# EasyEDA Pro project STM32F103C8T6_课设.eprj

# Schematic Mainboard
Create Date: 2023-09-07; Page Name: P1.Mainboard; Project Name: STM32F103C8T6_CAN; Schematic Name: Mainboard; Update Date: 2023-10-06; Company: 嘉立创EDA; Page Size: A4; Version: V1.0
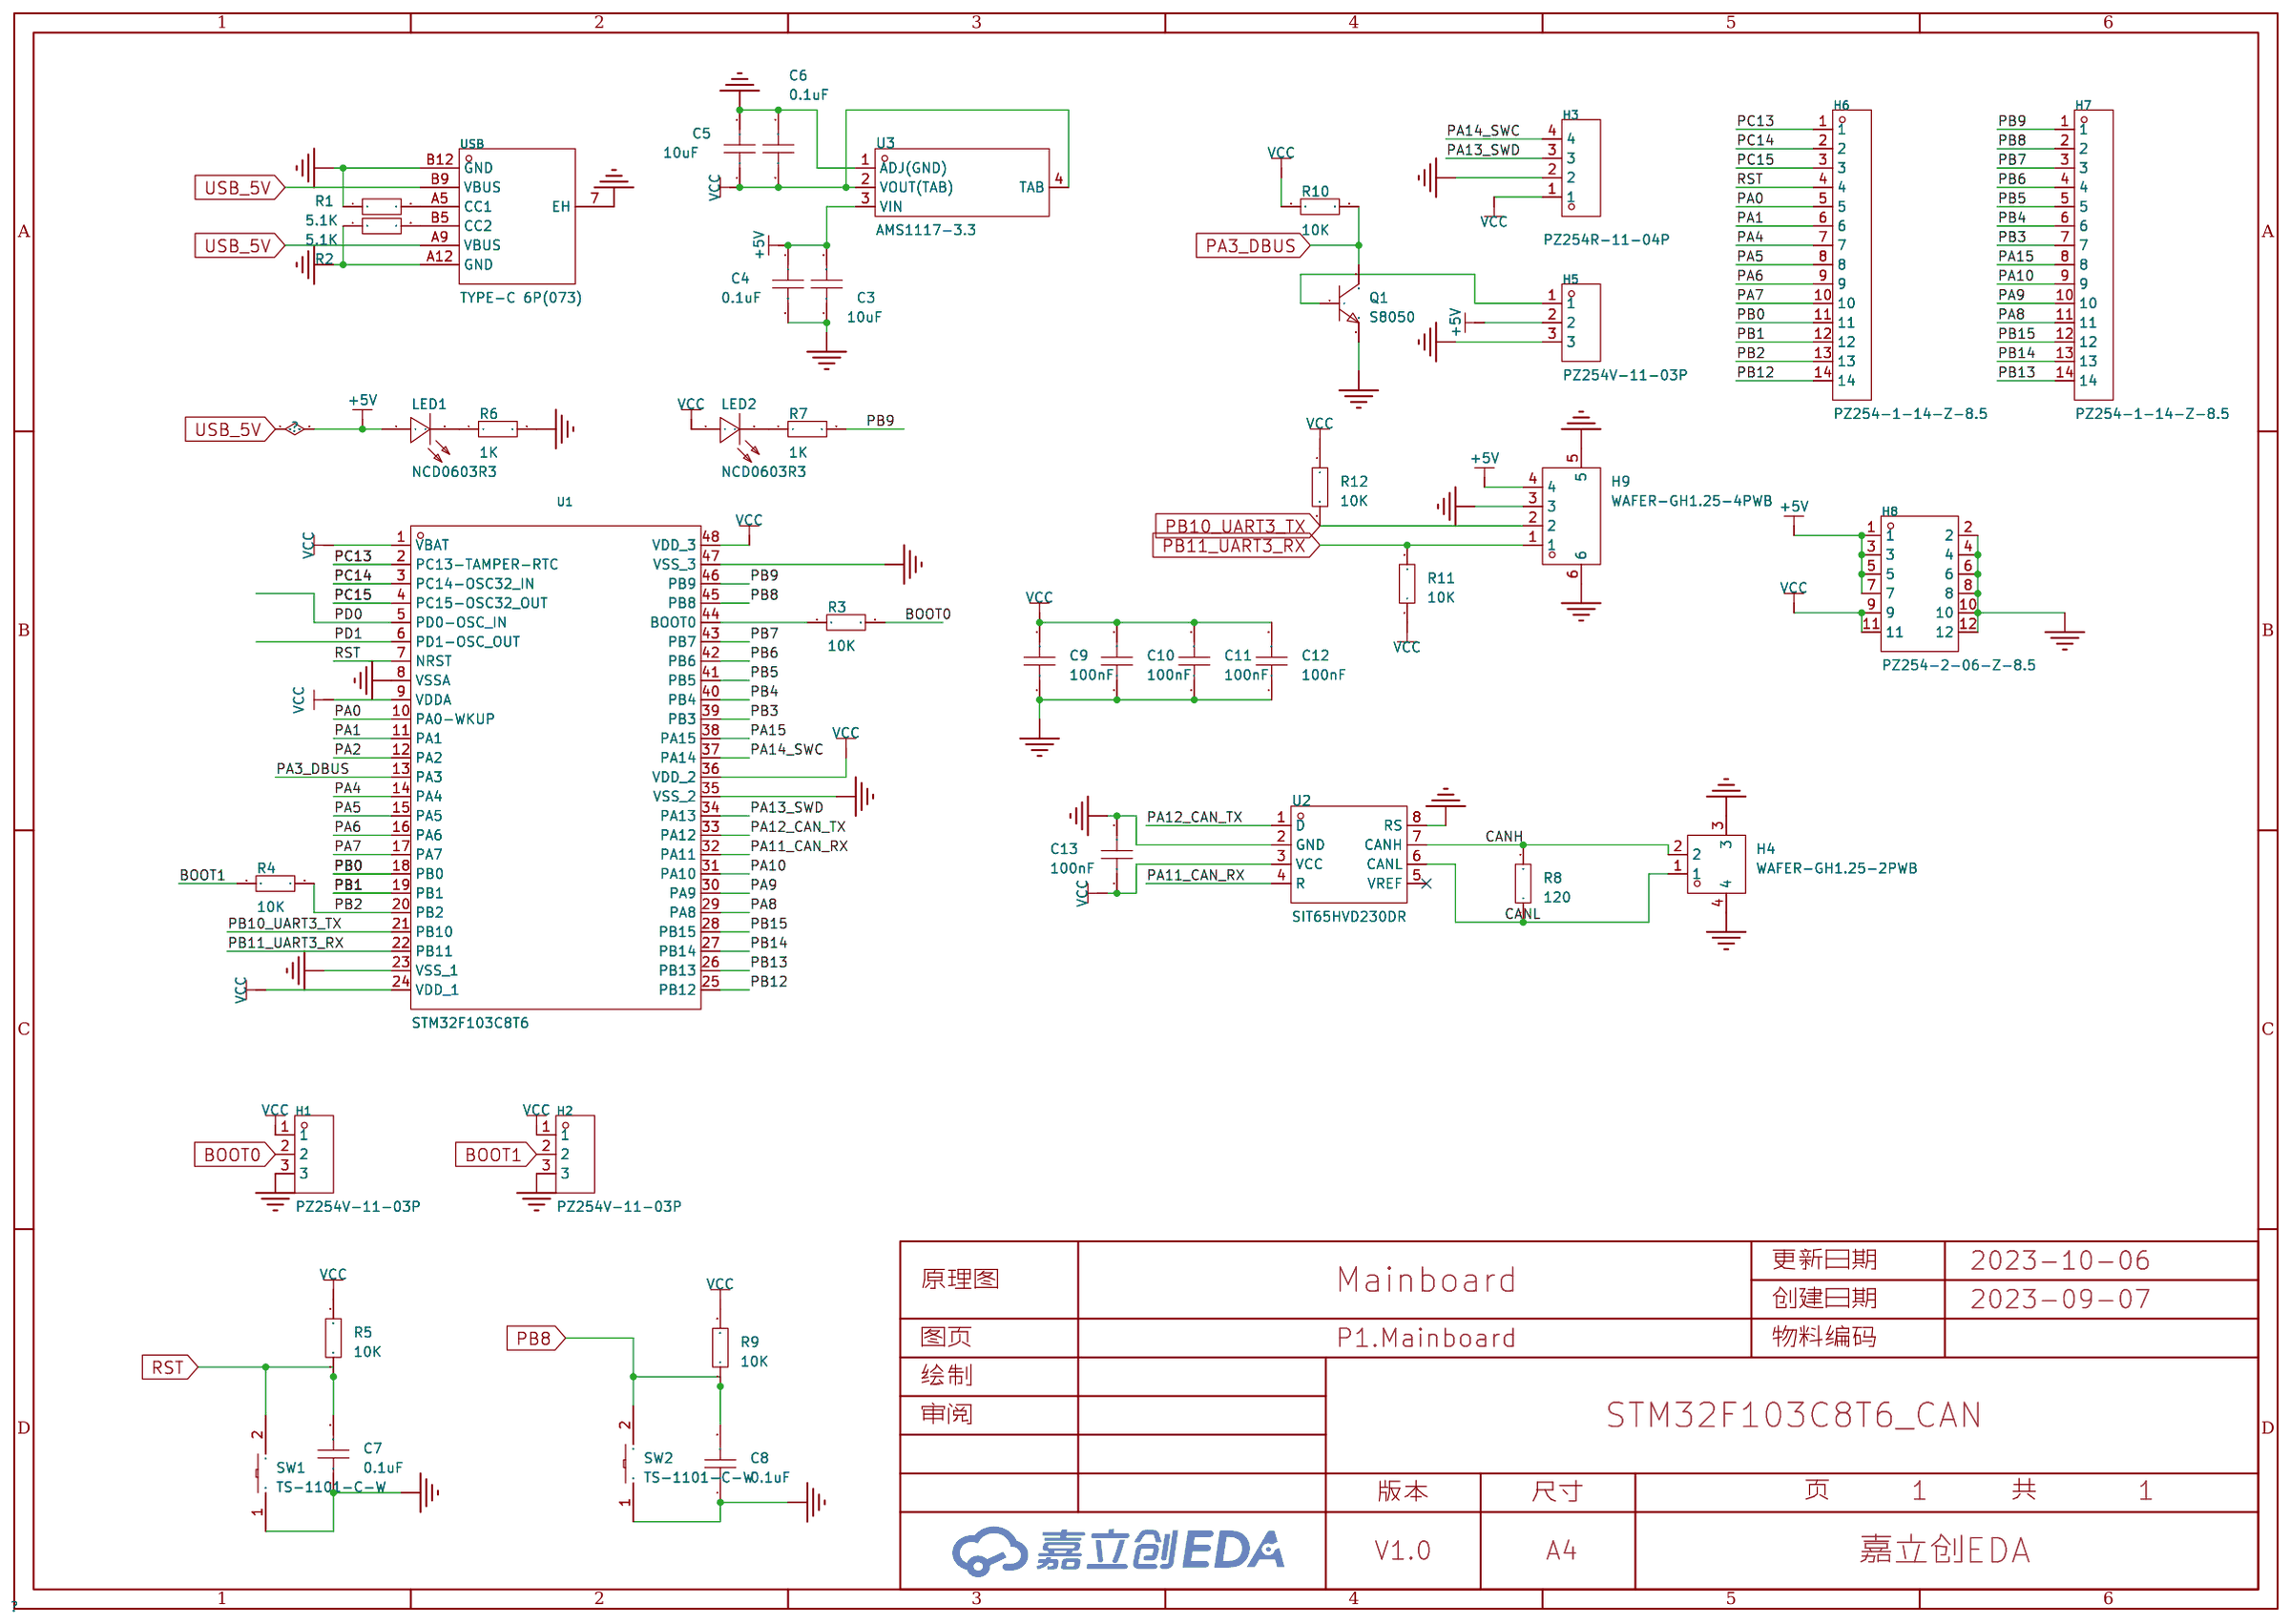
[diagram p0: schematic sheet]

## Parts
C3  10uF  [C0603]
C4  0.1uF  [C0603]
C5  10uF  [C0603]
C6  0.1uF  [C0603]
C7  0.1uF  [C0603]
C8  0.1uF  [C0603]
C9  100nF  [C0603]
C10  100nF  [C0603]
C11  100nF  [C0603]
C12  100nF  [C0603]
C13  100nF  [C0603]
CBB1  7327a17c6a034b8494f9f34925484f96
H1  PZ254V-11-03P  [HDR-TH_3P-P2.54-V-M]
H2  PZ254V-11-03P  [HDR-TH_3P-P2.54-V-M]
H3  PZ254R-11-04P  [HDR-TH_4P-P2.54-H-M-W10.4]
H4  WAFER-GH1.25-2PWB  [CONN-TH_2P-P1.25_XUNPU_WAFER-GH1.25-2PWB]
H5  PZ254V-11-03P  [HDR-TH_3P-P2.54-V-M]
H6  PZ254-1-14-Z-8.5  [HDR-TH_14P-P2.54-V-M]
H7  PZ254-1-14-Z-8.5  [HDR-TH_14P-P2.54-V-M]
H8  PZ254-2-06-Z-8.5  [HDR-TH_12P-P2.54-V-M-R2-C6-S2.54]
H9  WAFER-GH1.25-4PWB  [CONN-SMD_4P-P1.25_XUNPU_WAFER-GH1.25-4PWB]
LED1  NCD0603R3  [LED0603-R-RD_RED]
LED2  NCD0603R3  [LED0603-R-RD_RED]
Q1  S8050  [SOT-23-3_L2.9-W1.6-P1.90-LS2.8-BR]
R1  5.1K  [R0603]
R2  5.1K  [R0603]
R3  10K  [R0603]
R4  10K  [R0603]
R5  10K  [R0603]
R6  1K  [R0603]
R7  1K  [R0603]
R8  120  [R0603]
R9  10K  [R0603]
R10  10K  [R0603]
R11  10K  [R0603]
R12  10K  [R0603]
SW1  TS-1101-C-W  [SW-SMD_L6.0-W3.3-LS8.0]
SW2  TS-1101-C-W  [SW-SMD_L6.0-W3.3-LS8.0]
U1  STM32F103C8T6  [LQFP-48_L7.0-W7.0-P0.50-LS9.0-BL]
U2  SIT65HVD230DR  [SOP-8_L4.9-W3.9-P1.27-LS6.0-BL]
U3  AMS1117-3.3  [SOT-223-4_L6.5-W3.5-P2.30-LS7.0-BR]
USB  TYPE-C 6P(073)  [TYPE-C-SMD_TYPE-C-6P]

## Library data of the parts
C3-C13 = CAP_0603: Supplier Footprint: 0603
H1 H2 H5 = PZ254V-11-03P: 排数:单排;总PIN位数:3;间距:2.54mm;插针结构:1x3P;行距:-;安装类型:直插;圆针/方针:方针;额定电流:3A;额定电压:250V;配合针长度:6mm;塑高:2.5mm;端接针长度:3mm;工作温度范围:-40℃~+105℃;颜色:黑色;; LCSC Part Name: 2.54mm 1x3P 直插 方针; Supplier Part: C2937625; Manufacturer: XFCN(兴飞); Supplier Footprint: 直插,P=2.54mm; JLCPCB Part Class: Extended Part; Datasheet: 2022-07-12/581362A/62b9d00620994b3696be7eb4af85ad72/双排排针和单排排针.pdf; Supplier: LCSC; Number of Rows: 单排; Number of Pins: 3; Pitch: 2.54mm; Pin Structure: 1x3P; Mounting Type: 直插; Circluar Pins/Square Pins: 方针; Current Rating (Max): 3A; Voltage Rating (Max): 250V; Length of Mating Pin: 6mm; Insulation Height: 2.5mm; Length of End Connection Pin: 3mm; Operating Temperature Range: -40℃~+105℃; Color: 黑色
H3 = PZ254R-11-04P: 间距:2.54mm;总PIN位数:4;排数:1;插针结构:1x4P;行距:-;安装类型:弯插;圆针/方针:方针;额定电流:-;额定电压:-;配合针长度:6mm;塑高:2.5mm;触头材质:黄铜;触头镀层:-;工作温度范围:-40℃~+105℃;颜色:黑色;; LCSC Part Name: 2.54mm 1x4P 弯插 方针; Supplier Part: C492412; Manufacturer: XFCN(兴飞); Supplier Footprint: 插件,P=2.54mm; JLCPCB Part Class: 扩展库; Supplier: LCSC; Pitch: 2.54mm; Number of Pins: 4; Number of Rows: 1; Pin Structure: 1x4P; Mounting Type: 弯插; Circluar Pins/Square Pins: 方针; Length of Mating Pin: 6mm; Insulation Height: 2.5mm; Contact Material: 黄铜; Operating Temperature Range: -40℃~+105℃; Color: 黑色
H4 = WAFER-GH1.25-2PWB: 参考系列:GH;间距:1.25mm;插针结构:1x2P;排数:1;每排PIN数:2;公母:公型插针;安装方式:卧贴;额定电流:1A;工作温度范围:-25℃~+85℃;; LCSC Part Name: GH 1.25mm 1x2P 卧贴 带扣; Supplier Part: C3029377; Manufacturer: XUNPU(讯普); Supplier Footprint: SMD,P=1.25mm; JLCPCB Part Class: 扩展库; Datasheet: https://atta.szlcsc.com/upload/public/pdf/source/20220527/CB8773BFB0913C3B8ABD62CB38BA101A.pdf; Supplier: LCSC; Reference Series: GH; Pitch: 1.25mm; Pins Structure: 1x2P; Number of Rows: 1; Number of PINs Per Row: 2; Gender: 公型插针; Mounting Style: 卧贴; Current Rating (Max): 1A; Operating Temperature Range: -25℃~+85℃
H6 H7 = PZ254-1-14-Z-8.5: 排数:单排;总PIN位数:14P;间距:2.54mm;插针结构:1x14P;行距:-;安装类型:直插;圆针/方针:方针;额定电流:3A;额定电压:-;配合针长度:6mm;塑高:2.5mm;端接针长度:3mm;触头材质:-;工作温度范围:-40℃~+105℃;颜色:黑色;; LCSC Part Name: 2.54mm 1x14P 直插 方针; Supplier Part: C2894937; Manufacturer: HCTL(华灿天禄); Supplier Footprint: 插件,P=2.54mm; JLCPCB Part Class: 扩展库; Datasheet: https://atta.szlcsc.com/upload/public/pdf/source/20230609/805D25CEF03592837AF6F506EEB5ED41.pdf; Supplier: LCSC; Number of Rows: 单排; Number of Pins: 14P; Pitch: 2.54mm; Pin Structure: 1x14P; Mounting Type: 直插; Circluar Pins/Square Pins: 方针; Current Rating (Max): 3A; Length of Mating Pin: 6mm; Insulation Height: 2.5mm; Length of End Connection Pin: 3mm; Operating Temperature Range: -40℃~+105℃; Color: 黑色
H8 = PZ254-2-06-Z-8.5: 排数:双排;总PIN位数:12;间距:2.54mm;插针结构:2x6P;行距:2.54mm;安装类型:直插;圆针/方针:方针;额定电流:3A;额定电压:-;配合针长度:6mm;塑高:2.5mm;端接针长度:3mm;触头材质:-;工作温度范围:-40℃~+105℃;颜色:黑色;; LCSC Part Name: 2.54mm 2x6P 直插 方针; Supplier Part: C2894967; Manufacturer: HCTL(华灿天禄); Supplier Footprint: 直插,P=2.54mm; JLCPCB Part Class: 扩展库; Supplier: LCSC; Number of Rows: 双排; Number of Pins: 12; Pitch: 2.54mm; Pin Structure: 2x6P; Row Spacing: 2.54mm; Mounting Type: 直插; Circluar Pins/Square Pins: 方针; Current Rating (Max): 3A; Length of Mating Pin: 6mm; Insulation Height: 2.5mm; Length of End Connection Pin: 3mm; Operating Temperature Range: -40℃~+105℃; Color: 黑色
H9 = WAFER-GH1.25-4PWB: 参考系列:GH;间距:1.25mm;插针结构:1x4P;排数:1;每排PIN数:4;公母:公型插针;安装方式:卧贴;额定电流:1A;工作温度范围:-25℃~+85℃;; LCSC Part Name: GH1.25mm 4P 卧贴带扣 带扣; Supplier Part: C3029379; Manufacturer: XUNPU(讯普); Supplier Footprint: SMD,P=1.25mm; JLCPCB Part Class: 扩展库; Datasheet: https://atta.szlcsc.com/upload/public/pdf/source/20220527/CB8773BFB0913C3B8ABD62CB38BA101A.pdf; Supplier: LCSC; Reference Series: GH; Pitch: 1.25mm; Pins Structure: 1x4P; Number of Rows: 1; Number of PINs Per Row: 4; Gender: 公型插针; Mounting Style: 卧贴; Current Rating (Max): 1A; Operating Temperature Range: -25℃~+85℃
LED1 LED2 = NCD0603R3: 尺寸1.6x0.8x0.8；IF=20ma：1.6~2.6v，620~640nm,51~150mcd金线，光强高，功耗低，可靠性好，寿命长; LCSC Part Name: 红色;贴片LED;0603红灯;; Supplier Part: C3151730; Manufacturer: 国星光电; Supplier Footprint: 0603; JLCPCB Part Class: 扩展库; Datasheet: https://atta.szlcsc.com/upload/public/pdf/source/20220704/CBFF28C1847A97213A75929E60B7DDE7.pdf; Supplier: LCSC
Q1 = S8050_C181158: 晶体管类型:NPN;集射极击穿电压(Vceo):25V;集电极电流(Ic):500mA;功率(Pd):300mW;; LCSC Part Name: NPN 25V 500mA; Supplier Part: C181158; Manufacturer: Hottech(合科泰); Supplier Footprint: SOT-23; JLCPCB Part Class: 扩展库; Datasheet: https://atta.szlcsc.com/upload/public/pdf/source/20220506/D987F39D56F2975D34EC7947E75C4ABC.pdf; Supplier: LCSC; Transistor Type: NPN; Collector-Emitter Breakdown Voltage (Vceo): 25V; Collector Current (Ic): 500mA; Power Dissipation (Pd): 300mW; Collector Cut-Off Current (Icbo): 100nA; Collector-Emitter Saturation Voltage (VCE(sat)@Ic,Ib): 600mV@500mA,50mA; Transition Frequency (fT): 150MHz; Operating Temperature: +150℃@(Tj)
R1-R12 = Res_0603: Supplier Footprint: 0603
SW1 SW2 = TS-1101-C-W: 触点电流:50mA;额定电压(AC):-;额定电压(DC):12V;额定功率:-;绝缘电阻:-;电路结构:单刀单掷;安装方式:立贴;带灯:无;作用力:260gf;机械寿命:5万次;带支架:否;; LCSC Part Name: 立贴 6*3.6*2.5mm 轻触开关 一型3*6*2.5有白ZD b拉伸白色带淡绿按键 卷装; Supplier Part: C318938; Manufacturer: XKB Connectivity(中国星坤); Supplier Footprint: SMD; JLCPCB Part Class: Extended Part; Datasheet: https://atta.szlcsc.com/upload/public/pdf/source/20200227/C318938_C2E53B1EEDE37D980A33616AC086DE53.pdf; Supplier: LCSC; Contact Current: 50mA; Voltage Rating (DC): 12V; Circuit: 单刀单掷; Mounting Style: 立贴; Actuator Style: 矩形按钮; Actuator/Cap Color: 白色带淡绿; With Lamp: 无; Operating Force: 260gf; Mechanical Life: 5万次; Operating Temperature: -30℃~+85℃; Switch Length: 6mm; Switch Width: 3.6mm; Switch Height: 2.5mm; Strike Gundam: 否
U1 = STM32F103C8T6: CPU内核:ARM Cortex-M3;CPU最大主频:72MHz;工作电压范围:2V~3.6V;内部振荡器:有;程序 FLASH容量:64K@x8bit;RAM总容量:20KB;EEPROM/数据 FLASH容量:-;GPIO端口数量:37;ADC(单元数/通道数/位数):1@x10ch/12bit;外设/功能/协议栈:看门狗；DMA；看门狗；片载温度传感器;工作温度范围:-40℃~+85℃;; LCSC Part Name: ARM Cortex-M3 72MHz 闪存：64K@x8bit RAM：20KB MSL=3; Supplier Part: C8734; Manufacturer: ST(意法半导体); Supplier Footprint: LQFP-48(7x7); JLCPCB Part Class: 基础库; Supplier: LCSC; CPU Core: ARM Cortex-M3; Maximum Frequency: 72MHz; Supply Voltage Range: 2V~3.6V; Internal Oscillator: 有; Program FLASH Size: 64K@x8bit; RAM Size: 20KB; GPIO Ports Number: 37; ADC (Units/Channels/bits): 1@x10ch/12bit; Peripherals / Functions / Protocol Stacks: 看门狗；DMA；看门狗；片载温度传感器; Operating Temperature Range: -40℃~+85℃
U2 = SIT65HVD230DR: 类型:-;; Supplier Part: C496619; Manufacturer: SIT(芯力特); Supplier Footprint: SOP-8; JLCPCB Part Class: Extended Part; Datasheet: https://atta.szlcsc.com/upload/public/pdf/source/20200313/C496619_AFEDC6182C941FC5FA6F8E58312D272B.pdf; Supplier: LCSC
U3 = AMS1117-3.3_C347222: 输出类型:固定;输出极性:正;最大输入电压:18V;输出电压:3.3V;输出电流:1A;电源纹波抑制比(PSRR):60dB@(120Hz);; Supplier Part: C347222; Manufacturer: UMW(广东友台半导体); Supplier Footprint: SOT-223; JLCPCB Part Class: 扩展库; Datasheet: https://atta.szlcsc.com/upload/public/pdf/source/20211011/50CC665C22E3A66C08379A4A74BDA25C.pdf; Supplier: LCSC; Output Type: 固定; Output Polarity: 正; Number of Outputs: 1; Maximum Input Voltage: 18V; Output Voltage: 3.3V; Dropout Voltage: 1.3V@(1A); Output Current: 1A; Power Supply Rejection Ratio (PSRR): 60dB@(120Hz)
USB = TYPE-C 6P(073): 连接器类型:Type-C;标准:-;公母:母座;触点数量:6P;端口数量:1;安装方式:卧贴;额定电流 - 电源:5A;工作温度范围:-25℃~+85℃;; LCSC Part Name: Type-C 母座 卧贴; Supplier Part: C668623; Manufacturer: SHOU HAN(首韩); Supplier Footprint: SMD; JLCPCB Part Class: 扩展库; Datasheet: https://atta.szlcsc.com/upload/public/pdf/source/20200618/C668623_A4B260DED7AC1949BAC6AE39E9F4CD80.pdf; Supplier: LCSC; Connector Type: Type-C; Gender: 母座; Number of Contacts: 6P; Number of Ports: 1; Mounting Style: 卧贴; Current Rating - Power (Max): 5A; Operating Temperature Range: -25℃~+85℃

## Nets
+5V: C3.2 C4.1 H5.2 H8.1 H8.3 H8.5 H8.7 H9.4 LED1.1(A) U3.3(VIN) USB.A9(VBUS) USB.B9(VBUS)
GND: C3.1 C4.2 C5.2 C6.1 C7.1 C8.1 C9.1 C10.1 C11.1 C12.1 C13.2 H1.3 H2.3 H3.2 H4.3 H4.4 H5.3 H8.2 H8.4 H8.6 H8.8 H8.10 H8.12 H9.3 H9.5 H9.6 Q1.2 R1.1 R2.1 R6.2 SW1.1 SW2.1 U1.8(VSSA) U1.23(VSS_1) U1.35(VSS_2) U1.47(VSS_3) U2.2(GND) U2.8(RS) U3.1(ADJ(GND)) USB.7(EH) USB.A12(GND) USB.B12(GND)
VCC: C5.1 C6.2 C9.2 C10.2 C11.2 C12.2 C13.1 H1.1 H2.1 H3.1 H8.9 H8.11 LED2.1(A) R5.2 R9.2 R10.1 R11.1 R12.1 U1.1(VBAT) U1.9(VDDA) U1.24(VDD_1) U1.36(VDD_2) U1.48(VDD_3) U2.3(VCC) U3.2(VOUT(TAB)) U3.4(TAB)
BOOT0: H1.2 R3.2
BOOT1: H2.2 R4.1
CANH: H4.2 R8.2 U2.7(CANH)
CANL: H4.1 R8.1 U2.6(CANL)
PA0: H6.5 U1.10(PA0-WKUP)
PA1: H6.6 U1.11(PA1)
PA2: U1.12(PA2)
PA3_DBUS: Q1.3 R10.2 U1.13(PA3)
PA4: H6.7 U1.14(PA4)
PA5: H6.8 U1.15(PA5)
PA6: H6.9 U1.16(PA6)
PA7: H6.10 U1.17(PA7)
PA8: H7.11 U1.29(PA8)
PA9: H7.10 U1.30(PA9)
PA10: H7.9 U1.31(PA10)
PA11_CAN_RX: U1.32(PA11) U2.4(R)
PA12_CAN_TX: U1.33(PA12) U2.1(D)
PA13_SWD: H3.3 U1.34(PA13)
PA14_SWC: H3.4 U1.37(PA14)
PA15: H7.8 U1.38(PA15)
PB0: H6.11 U1.18(PB0)
PB1: H6.12 U1.19(PB1)
PB2: H6.13 R4.2 U1.20(PB2)
PB3: H7.7 U1.39(PB3)
PB4: H7.6 U1.40(PB4)
PB5: H7.5 U1.41(PB5)
PB6: H7.4 U1.42(PB6)
PB7: H7.3 U1.43(PB7)
PB8: C8.2 H7.2 R9.1 SW2.2 U1.45(PB8)
PB9: H7.1 R7.2 U1.46(PB9)
PB10_UART3_TX: H9.2 R12.2 U1.21(PB10)
PB11_UART3_RX: H9.1 R11.2 U1.22(PB11)
PB12: H6.14 U1.25(PB12)
PB13: H7.14 U1.26(PB13)
PB14: H7.13 U1.27(PB14)
PB15: H7.12 U1.28(PB15)
PC13: H6.1 U1.2(PC13-TAMPER-RTC)
PC14: H6.2 U1.3(PC14-OSC32_IN)
PC15: H6.3 U1.4(PC15-OSC32_OUT)
PD0: CBB1.(X2) U1.5(PD0-OSC_IN) U1.6(PD1-OSC_OUT)
RST: C7.2 H6.4 R5.1 SW1.2 U1.7(NRST)
$1N3196: R3.1 U1.44(BOOT0)
$1N3644: LED1.2(K) R6.1
$1N3970: LED2.2(K) R7.1
$1N9993: R2.2 USB.B5(CC2)
$1N9997: R1.2 USB.A5(CC1)
Net-(H5-1): H5.1 Q1.1

Not connected (* = marked no-connect by the designer): U2 5(VREF)*

# Schematic Crystal
Create Date: 2023-09-08; Page Name: P1; Project Name: STM32F103C8T6_CAN; Schematic Name: 8M_Crystal; Update Date: 2023-09-11; Company: 嘉立创EDA; Page Size: A4; Version: V1.0
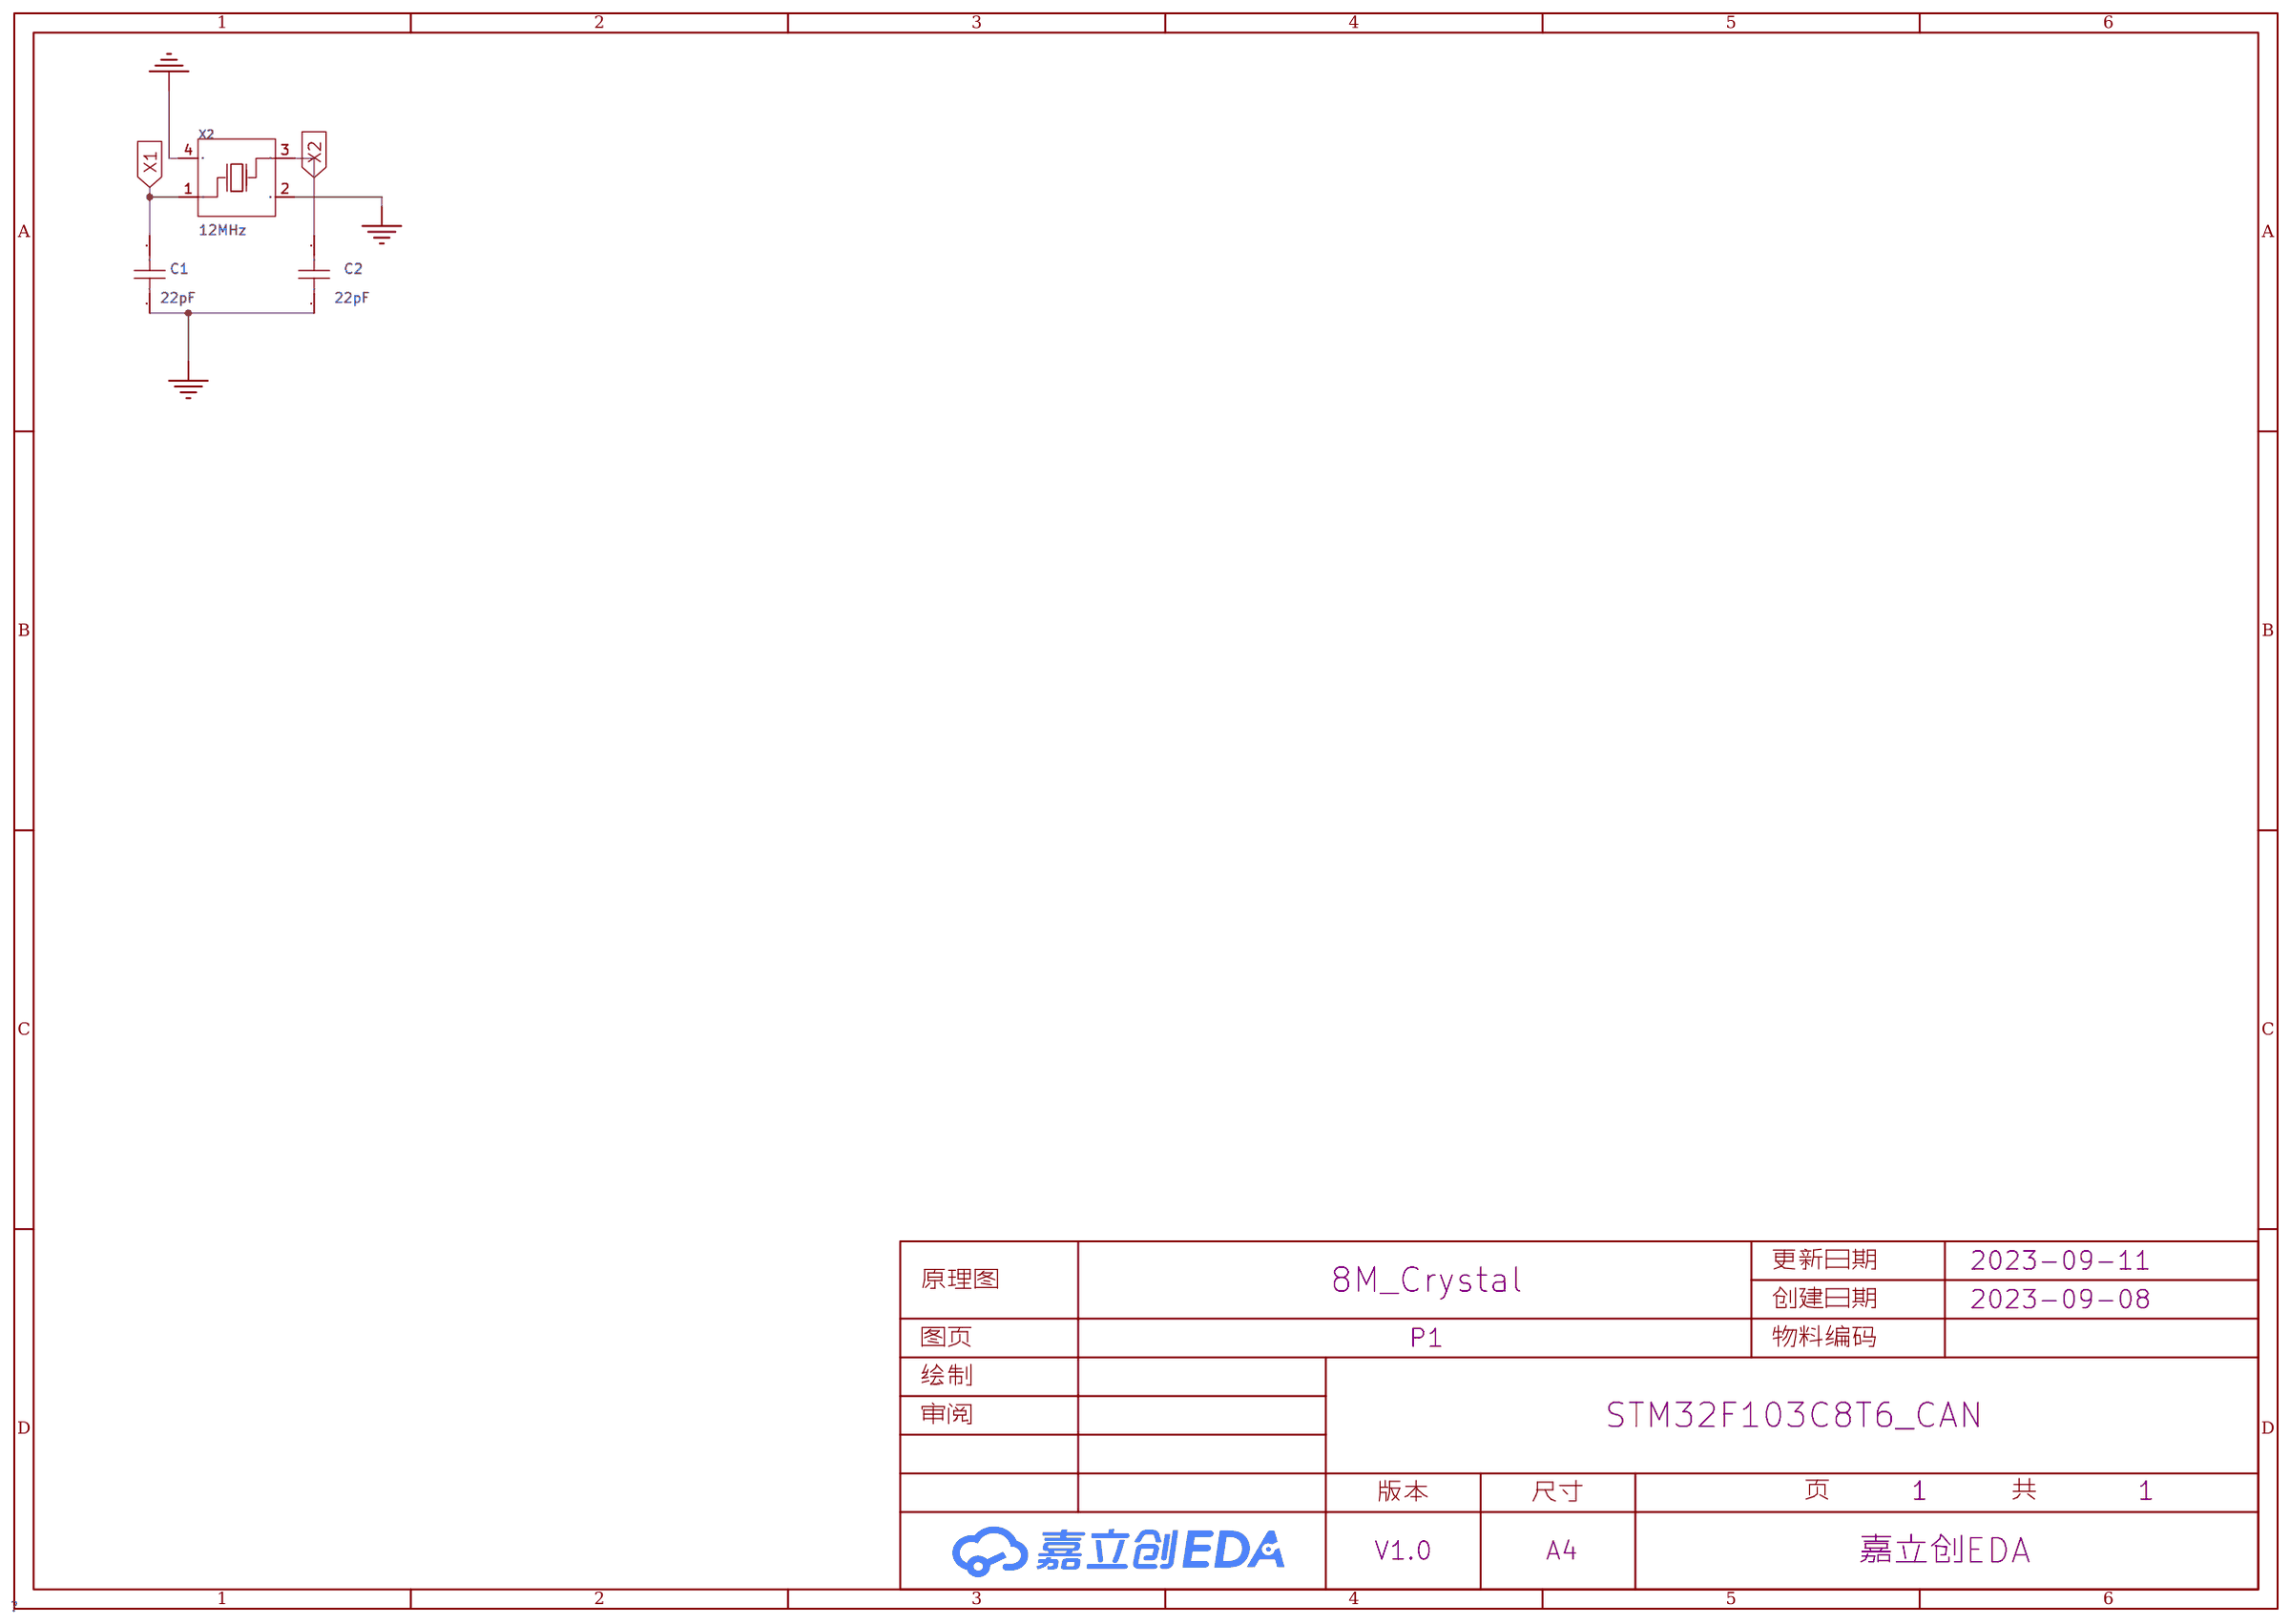
[diagram p1: schematic sheet]

## Parts
C1  22pF  [C0603]
C2  22pF  [C0603]
X2  12MHz  [OSC-SMD_4P-L3.2-W2.5-BL]

## Library data of the parts
C1 C2 = CAP_0603: Supplier Footprint: 0603
X2 = X322512MSB4SI: 频率:12MHz;频率公差:±10ppm;负载电容:20pF;; LCSC Part Name: 12MHz ±10ppm 20pF YSX321SL; Supplier Part: C9002; Manufacturer: YXC(扬兴晶振); Supplier Footprint: SMD3225-4P; JLCPCB Part Class: Basic Part; Datasheet: https://atta.szlcsc.com/upload/public/pdf/source/20210329/C112971_1F611BDC486E193C1706F6D8EB5AA189.pdf; Supplier: LCSC; Crystal Type: 贴片无源晶振; Frequency Tolerance: ±10ppm; Frequency Stability: ±30ppm; Load Capacitance: 20pF; Operating Temperature: -40℃~+85℃

## Nets
GND: C1.1 C2.1 X2.2(GND) X2.4(GND)
X1: C1.2 X2.1(OSC1)
X2: C2.2 X2.3(OSC2)

# Board PCB1
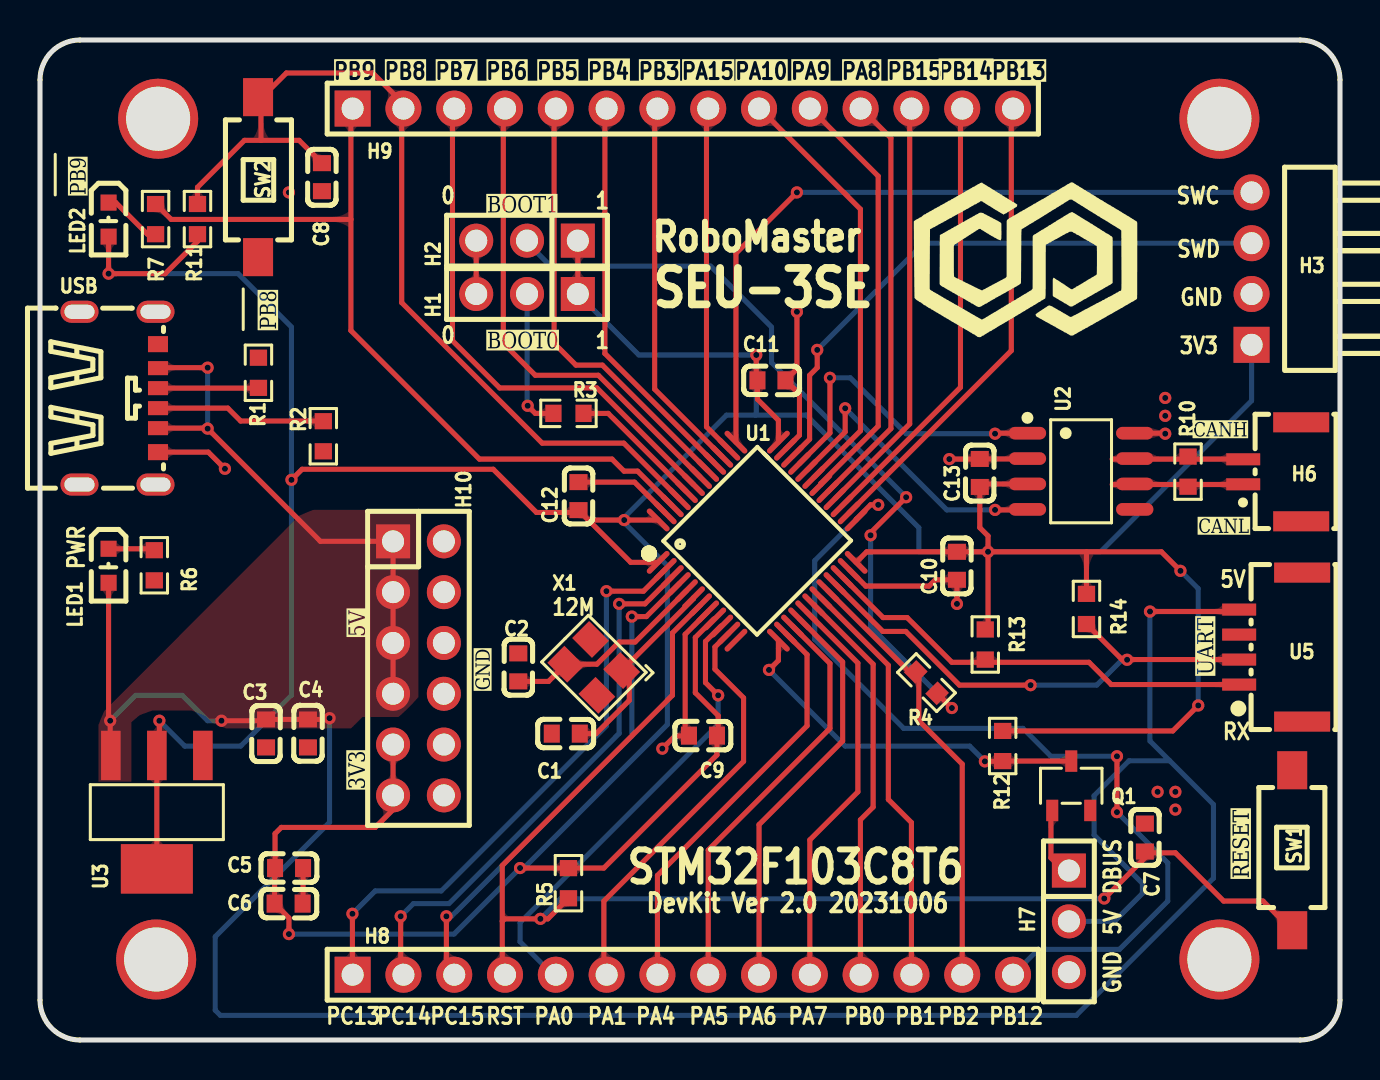
[diagram p2: board, top side]
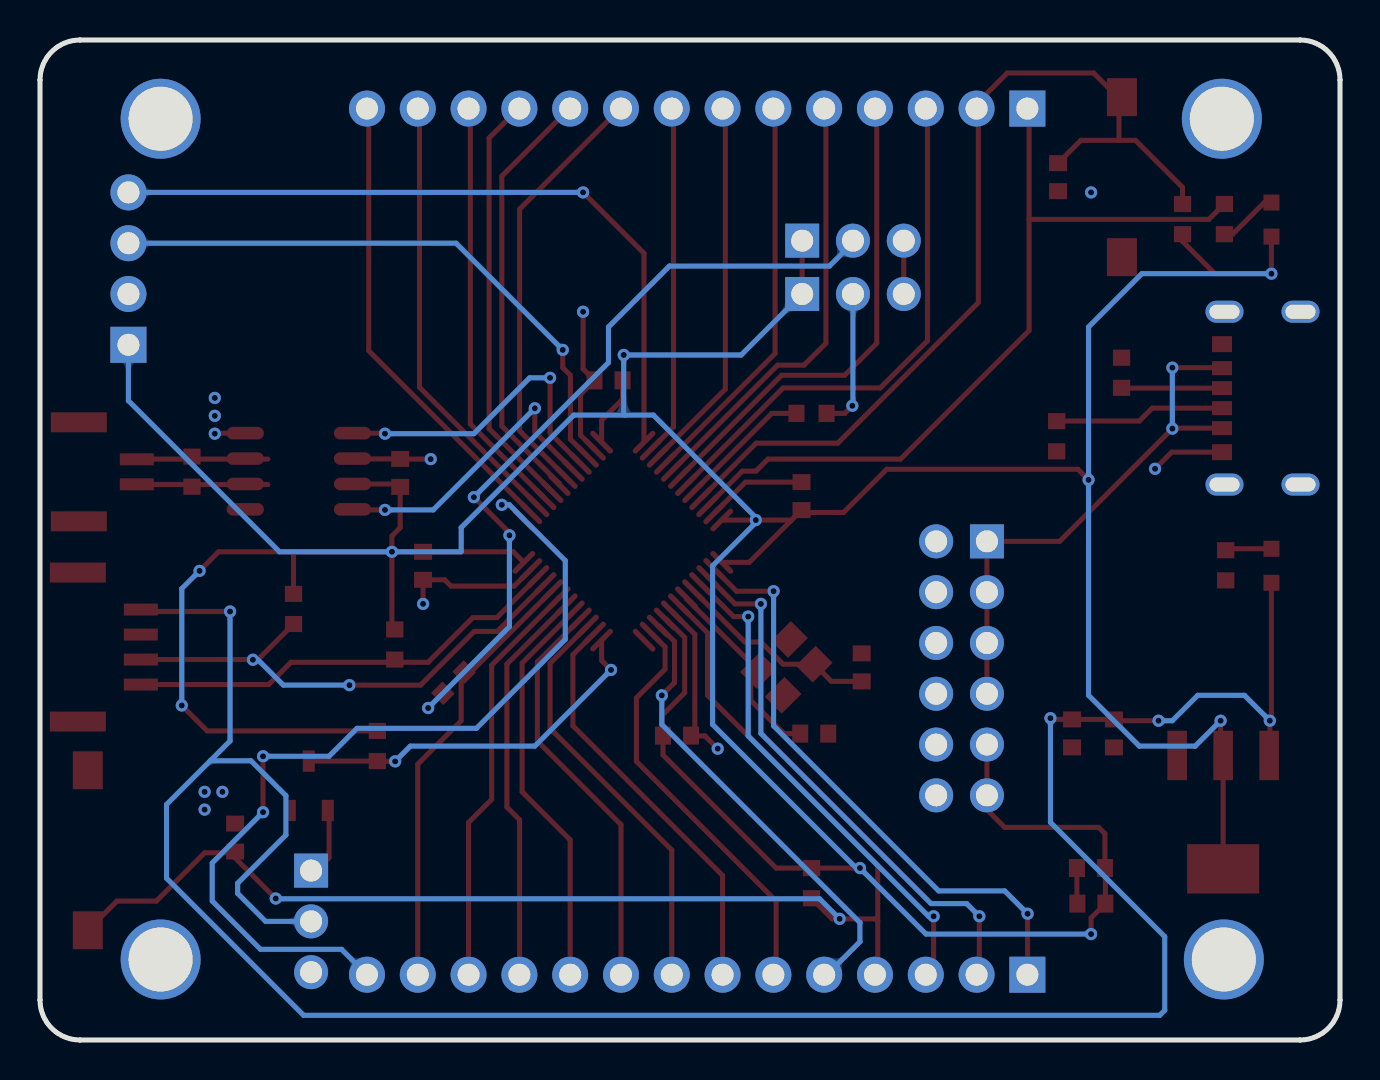
[diagram p3: board, bottom side, seen from below]

Outline 65 x 50 mm; copper layers: Top Layer, Bottom Layer. Coordinates in mm from the lower left corner of the outline.
Outline path: 0,48 0,2 arc(0.59,0.59) 2,0 63,0 arc(64.41,0.59) 65,2 65,48 arc(64.41,49.41) 63,50 2,50 arc(0.59,49.41) 0,48
Stack: Top Layer 0.035mm / Dielectric1 1.51mm FR4 er 4.5 / Bottom Layer 0.035mm

## Design rules (mm)
template: JLCPCB Capability(Two Layers Board)
spacing copperThickness1oz (default): track to track 0.102, other pairs 0.152 to 0.3
spacing copperThickness2oz: track to track 0.203, other pairs 0.152 to 0.3
track width copperThickness1oz (default): min 0.127, default 0.254, max 2.54
track width copperThickness2oz: min 0.203, default 0.254, max 2.54
differential pair differentialPair (default): width min 0.127, default 0.254, max 2.54; gap min 0.152, default 0.152
via viaSize (default): diameter min 0.5, default 0.61, max 10; hole min 0.3, default 0.305, max 6.3

## Placement (name value [footprint] x y rotation side)
C1  22pF  [C0603]  26.29 15.32 0 top
C2  22pF  [C0603]  23.91 18.63 270 top
C3  10uF  [C0603]  11.3 15.33 90 top
C4  0.1uF  [C0603]  13.4 15.33 270 top
C5  10uF  [C0603]  12.45 8.6 0 top
C6  0.1uF  [C0603]  12.43 6.82 180 top
C7  0.1uF  [C0603]  55.25 10.12 270 top
C8  0.1uF  [C0603]  14.1 43.14 90 top
C9  100nF  [C0603]  33.15 15.22 0 top
C10  100nF  [C0603]  45.85 23.71 90 top
C11  100nF  [C0603]  36.57 32.98 180 top
C12  100nF  [C0603]  26.92 27.19 270 top
C13  100nF  [C0603]  46.99 28.35 90 top
H1  PZ254V-11-03P  [HDR-TH_3P-P2.54-V-M]  24.35 37.3 180 top
H2  PZ254V-11-03P  [HDR-TH_3P-P2.54-V-M]  24.35 39.97 180 top
H3  PZ254R-11-04P  [HDR-TH_4P-P2.54-H-M-W10.4]  60.58 38.57 90 top
H6  PZ254-1-14-Z-8.5  [CONN-TH_2P-P1.25_XUNPU_WAFER-GH1.25-2PWB]  61.61 28.41 90 top
H7  PZ254-1-14-Z-8.5  [HDR-TH_3P-P2.54-V-M]  51.45 5.93 270 top
H8  PZ254-2-06-Z-8.5  [HDR-TH_14P-P2.54-V-M]  32.14 3.26 0 top
H9  WAFER-GH1.25-4PWB  [HDR-TH_14P-P2.54-V-M]  32.14 46.57 0 top
H10  PZ254-2-06-Z-8.5  [HDR-TH_12P-P2.54-V-M-R2-C6-S2.54]  18.92 18.58 270 top
LED1  NCD0603R3  [LED0603-R-RD_RED]  3.43 23.71 270 top
LED2  NCD0603R3  [LED0603-R-RD_RED]  3.43 41.02 270 top
NOREF  -  [Pad_e2540]  58.97 4.03 0 top
NOREF#2  -  [Pad_e2538]  58.97 46.06 0 top
NOREF#3  -  [Pad_e2198]  5.81 4.03 0 top
NOREF#4  -  [Pad_e825]  5.91 46.06 0 top
Q1  S8050  [SOT-23-3_L2.9-W1.6-P1.90-LS2.8-BR]  51.56 12.71 270 top
R1  5.1K  [R0603]  10.92 33.36 270 top
R2  5.1K  [R0603]  14.17 30.19 90 top
R3  10K  [R0603]  26.42 31.33 180 top
R4  10K  [R0603]  44.32 17.87 135 top
R5  10K  [R0603]  26.42 7.84 90 top
R6  1K  [R0603]  5.72 23.74 270 top
R7  1K  [R0603]  5.78 41.05 90 top
R10  10K  [R0603]  57.4 28.42 90 top
R11  10K  [R0603]  7.87 41.05 270 top
R12  10K  [R0603]  48.13 14.7 270 top
R13  10K  [R0603]  47.26 19.77 270 top
R14  10K  [R0603]  52.32 21.55 270 top
SW1  TS-1101-C-W  [SW-SMD_L6.0-W3.3-LS8.0]  62.61 9.49 270 top
SW2  TS-1101-C-W  [SW-SMD_L6.0-W3.3-LS8.0]  10.9 43.14 90 top
U1  STM32F103C8T6  [LQFP-48_L7.0-W7.0-P0.50-LS9.0-BL]  35.86 24.94 315 top
U2  SIT65HVD230DR  [SOP-8_L4.9-W3.9-P1.27-LS6.0-BL]  52.05 28.44 270 top
U3  AMS1117-3.3  [SOT-223-4_L6.5-W3.5-P2.30-LS7.0-BR]  5.84 11.39 90 top
U5  WAFER-GH1.25-4PWB  [CONN-SMD_4P-P1.25_XUNPU_WAFER-GH1.25-4PWB]  61.53 19.65 90 top
USB  TYPE-C 6P(073)  [TYPE-C-SMD_TYPE-C-6P]  3.94 32.09 270 top
X1  12MHz  [OSC-SMD_4P-L3.2-W2.5-BL]  27.69 18.63 135 top

## Footprints (pads in the part's own frame, mm; a bottom-side part is the same pattern mirrored in y, then rotated)
C0603
  rect 0.8x0.9 smd: 1(-0.7,0) 2(0.7,0)
CONN-SMD_4P-P1.25_XUNPU_WAFER-GH1.25-4PWB
  rect 0.6x1.7 smd: 1(-1.875,1.575) 2(-0.625,1.575) 3(0.625,1.575) 4(1.875,1.575)
  rect 1x2.8 smd: 5(3.725,-1.575) 6(-3.725,-1.575)
CONN-TH_2P-P1.25_XUNPU_WAFER-GH1.25-2PWB
  rect 0.6x1.7 smd: 1(-0.625,1.45) 2(0.625,1.45)
  rect 1x2.8 smd: 3(-2.475,-1.45) 4(2.475,-1.45)
HDR-TH_3P-P2.54-V-M
  rect 1.7x1.7 hole 1.1: 1(-2.54,0)
  round 1.7 hole 1.1: 2(0,0) 3(2.54,0)
HDR-TH_4P-P2.54-H-M-W10.4
  rect 1.8x1.8 hole 1.1: 1(-3.81,0)
  round 1.8 hole 1.1: 2(-1.27,0) 3(1.27,0) 4(3.81,0)
HDR-TH_12P-P2.54-V-M-R2-C6-S2.54
  rect 1.7x1.7 hole 1.1: 1(-6.35,-1.27)
  round 1.7 hole 1.1: 2(-6.35,1.27) 3(-3.81,-1.27) 4(-3.81,1.27) 5(-1.27,-1.27) 6(-1.27,1.27) 7(1.27,-1.27) 8(1.27,1.27) 9(3.81,-1.27) 10(3.81,1.27) 11(6.35,-1.27) 12(6.35,1.27)
HDR-TH_14P-P2.54-V-M
  rect 1.8x1.8 hole 1.1: 1(-16.51,0)
  round 1.8 hole 1.1: 2(-13.97,0) 3(-11.43,0) 4(-8.89,0) 5(-6.35,0) 6(-3.81,0) 7(-1.27,0) 8(1.27,0) 9(3.81,0) 10(6.35,0) 11(8.89,0) 12(11.43,0) 13(13.97,0) 14(16.51,0)
LED0603-R-RD_RED
  rect 0.8x0.8 smd: 1(0.851,0) 2(-0.851,0)
LQFP-48_L7.0-W7.0-P0.50-LS9.0-BL
  oval 0.27x1.5 smd: 1(-2.75,-4.25) 2(-2.25,-4.25) 3(-1.75,-4.25) 4(-1.25,-4.25) 5(-0.75,-4.25) 6(-0.25,-4.25) 7(0.25,-4.25) 8(0.75,-4.25) 9(1.25,-4.25) 10(1.75,-4.25) 11(2.25,-4.25) 12(2.75,-4.25) 25(2.75,4.25) 26(2.25,4.25) 27(1.75,4.25) 28(1.25,4.25) 29(0.75,4.25) 30(0.25,4.25) 31(-0.25,4.25) 32(-0.75,4.25) 33(-1.25,4.25) 34(-1.75,4.25) 35(-2.25,4.25) 36(-2.75,4.25)
  oval 1.5x0.27 smd: 13(4.25,-2.75) 14(4.25,-2.25) 15(4.25,-1.75) 16(4.25,-1.25) 17(4.25,-0.75) 18(4.25,-0.25) 19(4.25,0.25) 20(4.25,0.75) 21(4.25,1.25) 22(4.25,1.75) 23(4.25,2.25) 24(4.25,2.75) 37(-4.25,2.75) 38(-4.25,2.25) 39(-4.25,1.75) 40(-4.25,1.25) 41(-4.25,0.75) 42(-4.25,0.25) 43(-4.25,-0.25) 44(-4.25,-0.75) 45(-4.25,-1.25) 46(-4.25,-1.75) 47(-4.25,-2.25) 48(-4.25,-2.75)
OSC-SMD_4P-L3.2-W2.5-BL
  rect 1.4x1.2 smd: 1(-1.1,-0.875) 2(1.1,-0.875) 3(1.1,0.875) 4(-1.1,0.875)
Pad_e825
  round 4 hole 3.2: 15(0,0)
Pad_e2198
  round 4 hole 3.2: 15(0,0)
Pad_e2538
  round 4 hole 3.2: 15(0,0)
Pad_e2540
  round 4 hole 3.2: 15(0,0)
R0603
  rect 0.806x0.864 smd: 1(-0.753,0) 2(0.753,0)
SOP-8_L4.9-W3.9-P1.27-LS6.0-BL
  oval 0.63x1.865 smd: 1(-1.905,-2.683) 2(-0.635,-2.683) 3(0.635,-2.683) 4(1.905,-2.683) 5(1.905,2.683) 6(0.635,2.683) 7(-0.635,2.683) 8(-1.905,2.683)
SOT-23-3_L2.9-W1.6-P1.90-LS2.8-BR
  rect 1.07x0.6 smd: 1(1.235,-0.95) 2(1.235,0.95) 3(-1.235,0)
SOT-223-4_L6.5-W3.5-P2.30-LS7.0-BR
  rect 2.47x0.98 smd: 1(2.835,-2.3) 2(2.835,0) 3(2.835,2.3)
  rect 2.47x3.6 smd: 4(-2.835,0)
SW-SMD_L6.0-W3.3-LS8.0
  rect 1.9x1.5 smd: 1(-4,0) 2(4,0)
TYPE-C-SMD_TYPE-C-6P
  oval 1.1x1.9 hole 0.7x1.5: 7(-4.32,1.837) 7(-4.32,-1.962) 7(4.32,1.837) 7(4.32,-1.962)
  rect 0.7x1 smd: A5(-0.5,1.962) A9(1.5,1.962) B5(0.5,1.962) B9(-1.5,1.962)
  rect 0.8x1 smd: A12(2.7,1.962) B12(-2.7,1.962)

## Nets
+5V: C3.2 C4.1 H7.2 H10.1 H10.3 H10.5 H10.7 LED1.1 U3.3 U5.4 USB.A9 USB.B9
GND: C1.1 C2.1 C3.1 C4.2 C5.2 C6.1 C7.1 C8.1 C9.1 C10.1 C11.1 C12.1 C13.2 H1.3 H2.3 H3.2 H6.3 H6.4 H7.3 H10.2 H10.4 H10.6 H10.8 H10.10 H10.12 NOREF.15 NOREF#2.15 NOREF#3.15 NOREF#4.15 Q1.2 R1.1 R2.1 R6.2 SW1.1 SW2.1 U1.8 U1.23 U1.35 U1.47 U2.2 U2.8 U3.1 U5.3 U5.5 U5.6 USB.7 USB.A12 USB.B12 X1.2 X1.4
VCC: C5.1 C6.2 C9.2 C10.2 C11.2 C12.2 C13.1 H1.1 H2.1 H3.1 H10.9 H10.11 LED2.1 R5.2 R11.2 R12.1 R13.1 R14.1 U1.1 U1.9 U1.24 U1.36 U1.48 U2.3 U3.2 U3.4
BOOT0: H1.2 R3.2
BOOT1: H2.2 R4.1
CANH: H6.2 R10.2 U2.7
CANL: H6.1 R10.1 U2.6
PA0: H8.5 U1.10
PA1: H8.6 U1.11
PA2: U1.12
PA3_DBUS: Q1.3 R12.2 U1.13
PA4: H8.7 U1.14
PA5: H8.8 U1.15
PA6: H8.9 U1.16
PA7: H8.10 U1.17
PA8: H9.11 U1.29
PA9: H9.10 U1.30
PA10: H9.9 U1.31
PA11_CAN_RX: U1.32 U2.4
PA12_CAN_TX: U1.33 U2.1
PA13_SWD: H3.3 U1.34
PA14_SWC: H3.4 U1.37
PA15: H9.8 U1.38
PB0: H8.11 U1.18
PB1: H8.12 U1.19
PB2: H8.13 R4.2 U1.20
PB3: H9.7 U1.39
PB4: H9.6 U1.40
PB5: H9.5 U1.41
PB6: H9.4 U1.42
PB7: H9.3 U1.43
PB8: C8.2 H9.2 R11.1 SW2.2 U1.45
PB9: H9.1 R7.2 U1.46
PB10_UART3_TX: R14.2 U1.21 U5.2
PB11_UART3_RX: R13.2 U1.22 U5.1
PB12: H8.14 U1.25
PB13: H9.14 U1.26
PB14: H9.13 U1.27
PB15: H9.12 U1.28
PC13: H8.1 U1.2
PC14: H8.2 U1.3
PC15: H8.3 U1.4
PD0: C2.2 U1.5 X1.3
PD1: C1.2 U1.6 X1.1
RST: C7.2 H8.4 R5.1 SW1.2 U1.7
$1N3196: R3.1 U1.44
$1N3644: LED1.2 R6.1
$1N3970: LED2.2 R7.1
$1N9993: R2.2 USB.B5
$1N9997: R1.2 USB.A5
$1N21284: H7.1 Q1.1

Pads without a net: U2 5

## Via types
v1: diameter 0.61, hole 0.305, Top Layer to Bottom Layer, 54 vias

## Routing (per net, layer and track width the routed paths; a pad name or vN(x,y) marks a point on that pad's centre or on a via; arc(x,y) is an arc through that point)
+5V: length 151.9
  Top Layer w0.254: H10.7 H10.5 H10.3 H10.1 14.02,24.93 v1(8.38,30.57) 8.36,30.59 USB.A9 ; v1(14.48,16.09) 14.42,16.03 C4.1 C3.2 11.24,15.96 v1(9.07,15.96) ; v1(8.38,33.62) 5.92,33.62 USB.B9 ; v1(55.5,21.42) 59.86,21.42 59.96,21.52 ; 3.51,13.97 v1(3.51,15.96) 3.43,16.04 LED1.1
  Bottom Layer w0.254: 56.49,13.96 58.67,11.77 58.67,8.09 51.82,1.23 9.02,1.23 8.76,1.49 8.76,5.17 14.48,10.88 v1(14.48,16.09) ; 56.49,13.96 54.45,13.96 52.71,12.22 52.71,10.25 55.12,7.84 55.12,7.33 53.72,5.93 H7.2 ; 56.49,13.96 55.5,14.95 v1(55.5,21.42) ; v1(8.38,30.57) v1(8.38,33.62) ; v1(3.51,15.96) 4.78,17.23 7.11,17.23 8.38,15.96 v1(9.07,15.96)
GND: length 41.7
  Top Layer w0.254: v1(9.25,28.56) 8.41,29.39 USB.A12 ; v1(56.26,30.31) 56.24,30.34 54.74,30.34 ; U1.47 29.72,27.89 C12.1 ; 33.38,21.41 32.26,20.28 32.26,15.41 32.45,15.22 ; C9.1 32.43,15.2 31.75,15.2 v1(31.12,14.57) ; v1(45.47,29.05) 46.98,29.05 C13.2 49.35,29.05 U2.2 ; 37.27,29.54 37.97,30.24 37.97,32.28 C11.1 37.85,33.56 v1(37.85,36.41) ; v1(45.85,21.81) C10.1 44.77,23.01 44.45,22.69 41.29,22.69 U1.23 ; H2.3 H1.3 ; C6.1 13.15,6.84 C5.2
  vias: v1(12.45,42.38) v1(55.88,12.41) v1(56.26,32.1) v1(56.26,31.21) v1(56.77,12.41) v1(56.77,11.52)
VCC: length 255.2
  Top Layer w0.254: v1(5.97,15.96) 5.97,14.13 5.84,14.01 ; v1(12.45,5.3) 12.45,6.1 C6.2 11.73,8.57 C5.1 11.75,10.32 12.06,10.63 16.76,10.63 17.65,11.52 H10.11 H10.9 ; 58.04,16.85 56.64,15.45 R12.1 ; 33.69,21.05 32.77,20.13 32.77,17.36 33.91,16.22 33.91,15.55 33.85,15.48 C9.2 33.85,14.25 28.19,8.6 v1(24,8.6) ; U2.3 47.14,27.8 C13.1 46.99,25.62 47.4,25.2 v1(47.4,24.41) ; 52.32,24.41 v1(47.4,24.41) ; 52.32,24.41 56.07,24.41 v1(57.02,23.46) ; 52.32,24.41 R14.1 ; v1(47.4,24.41) C10.2 41.34,24.41 U1.24 ; v1(47.4,24.41) 47.4,20.67 47.42,20.65 ; 5.84,14.23 5.84,14.01 ; 5.84,14.01 U3.4 ; 5.84,14.01 5.81,13.97 ; 27.42,26 29.54,23.88 U1.1 ; 27.42,26 v1(29.21,26) 30.9,26 U1.48 ; 27.42,26 C12.2 26.81,26.38 24.82,26.38 22.66,28.54 13.1,28.54 v1(12.57,28.01) ; R11.2 7.87,39.93 6.26,38.32 v1(3.43,38.32) LED2.1 ; v1(35.81,34.25) 35.81,33.04 C11.2 35.87,32.03 36.92,30.99 U1.36 ; H2.1 H1.1
  Bottom Layer w0.254: 35.76,31.24 35.81,31.3 v1(35.81,34.25) 29.94,34.25 H1.1 ; 35.76,31.24 34.33,31.24 29.08,26 31.37,23.71 31.37,15.77 24.19,8.6 v1(24,8.6) 20.7,5.3 v1(12.45,5.3) ; 35.76,31.24 38.31,31.24 43.94,25.62 43.94,24.41 v1(47.4,24.41) 53.02,24.41 60.58,31.97 H3.1 ; v1(57.91,16.73) 57.91,22.57 v1(57.02,23.46) ; v1(3.43,38.32) 9.91,38.32 12.57,35.65 v1(12.57,28.01) 12.57,17.23 10.03,14.69 7.24,14.69 v1(5.97,15.96)
BOOT0: length 7
  Top Layer w0.254: R3.2 24.76,31.33 v1(24.38,31.71)
  Bottom Layer w0.254: H1.2 24.35,31.74 v1(24.38,31.71)
BOOT1: length 39.4
  Top Layer w0.254: v1(45.59,16.6) R4.1 ; v1(43.31,27.14) 41.53,25.36 v1(41.53,25.23)
  Bottom Layer w0.254: H2.2 24.35,39.87 25.53,38.7 33.53,38.7 36.58,35.65 36.58,33.87 v1(43.31,27.14) ; v1(45.59,16.6) 41.53,20.66 v1(41.53,25.23)
CANH: length 6.1
  Top Layer w0.254: 53.61,29.05 59.73,29.05 59.72,29.05
CANL: length 6.1
  Top Layer w0.254: 53.61,27.78 59.69,27.78 59.72,27.8
PA0: length 22.8
  Top Layer w0.254: v1(33.91,17.23) 33.27,17.87 33.27,19.93 34.05,20.7
  Bottom Layer w0.254: 25.65,3.26 24,4.92 24,5.87 33.91,15.77 v1(33.91,17.23)
PA1: length 20.9
  Top Layer w0.254: U1.11 33.75,19.65 33.75,18.54 35.18,17.11 35.18,13.93 28.19,6.95 28.19,3.26
PA3_DBUS: length 18.7
  Top Layer w0.254: v1(36.45,18.5) 36.92,18.97 U1.13 ; v1(47.24,13.93) 48.12,13.93 R12.2 Q1.3
  Bottom Layer w0.254: v1(36.45,18.5) 40.26,14.69 46.48,14.69 v1(47.24,13.93)
PA4: length 20.6
  Top Layer w0.254: U1.14 38.35,19.27 38.35,15.71 30.87,8.23 H8.7
PA5: length 20.7
  Top Layer w0.254: U1.15 39.5,18.83 39.5,15.58 33.41,9.5 H8.8
PA6: length 20.4
  Top Layer w0.254: H8.9 35.95,10.77 40.13,14.95 40.13,18.9 U1.16
PA7: length 20.2
  Top Layer w0.254: H8.10 38.49,10.01 40.89,12.41 40.89,18.85 38.33,21.41
PA8: length 21.2
  Top Layer w0.254: 40.94,46.7 42.54,45.1 42.54,30.57 U1.29
PA9: length 21.6
  Top Layer w0.254: 38.4,46.7 41.91,43.19 41.91,30.7 39.04,27.83 39.04,27.77
PA10: length 21.7
  Top Layer w0.254: 35.86,46.7 41.02,41.54 41.02,30.46 38.69,28.12
PA11_CAN_RX: length 15.1
  Top Layer w0.254: v1(40.26,31.58) 40.26,30.4 38.33,28.48 ; U2.4 49.35,26.5 v1(47.75,26.5)
  Bottom Layer w0.254: v1(47.75,26.5) 45.34,26.5 v1(40.26,31.58)
PA12_CAN_TX: length 15.9
  Top Layer w0.254: U1.33 39.5,30.35 v1(39.5,33.11) ; v1(47.75,30.31) 47.78,30.34 49.37,30.34
  Bottom Layer w0.254: v1(39.5,33.11) 40.51,33.11 43.31,30.31 v1(47.75,30.31)
PA13_SWD: length 29.8
  Top Layer w0.254: v1(38.86,34.51) 38.86,33.62 38.48,33.24 38.48,30.04 U1.34
  Bottom Layer w0.254: v1(38.86,34.51) 44.2,39.84 H3.3
PA14_SWC: length 36.4
  Top Layer w0.254: U1.37 34.8,39.33 v1(37.85,42.38)
  Bottom Layer w0.254: 60.45,42.38 v1(37.85,42.38)
PA15: length 17.6
  Top Layer w0.254: 33.32,46.7 33.32,30.66 34.44,29.54
PB0: length 20
  Top Layer w0.254: H8.11 41.02,3.27 41.02,11.01 41.66,11.65 41.66,18.79 38.69,21.76
PB1: length 20.7
  Top Layer w0.254: U1.19 42.42,18.74 42.42,12.03 43.57,10.87 H8.12
PB2: length 22.2
  Top Layer w0.254: U1.20 43.46,18.4 R4.2 43.94,18.25 43.94,15.96 46.11,13.79 H8.13
PB3: length 18.9
  Top Layer w0.254: 30.78,46.7 30.73,46.65 30.73,32.54 U1.39
PB4: length 20.1
  Top Layer w0.254: 33.74,28.83 28.24,34.32 28.24,46.7
PB5: length 22.2
  Top Layer w0.254: 25.7,46.7 25.7,34.84 26.8,33.74 28.12,33.74 U1.41
PB6: length 24.5
  Top Layer w0.254: U1.42 27.92,33.24 24.76,33.24 23.16,34.84 23.16,46.7
PB7: length 26.8
  Top Layer w0.254: 32.68,27.77 27.84,32.6 22.99,32.6 20.62,34.96 20.62,46.7
PB8: length 46.9
  Top Layer w0.254: 18.08,46.7 18.08,36.87 25.11,29.84 29.19,29.84 U1.45 ; C8.2 12.96,44.98 11.05,44.98 ; 11.05,44.98 10.22,44.98 7.87,42.63 R11.1 ; 11.05,44.98 11.05,47.08 12.32,48.35 16.64,48.35 18.17,46.81 H9.2
PB9: length 41
  Top Layer w0.254: 15.54,46.7 15.54,41.03 ; 15.54,41.03 15.54,35.47 21.97,29.05 28.6,29.05 29.2,28.44 29.88,28.44 U1.46 ; 15.54,41.03 6.56,41.03 5.84,41.75 5.84,41.8
PB10_UART3_TX: length 25.6
  Top Layer w0.254: 59.96,19.02 54.37,19.02 v1(54.36,19.01) 54.11,19.01 R14.2 ; v1(49.53,17.74) 45.97,17.74 43.29,20.43 42.14,20.43 U1.21
  Bottom Layer w0.254: v1(54.36,19.01) 54.1,19.01 52.83,17.74 v1(49.53,17.74)
PB11_UART3_RX: length 22.1
  Top Layer w0.254: 59.96,17.77 53.56,17.77 52.45,18.89 45.59,18.89 43.36,21.12 42.16,21.12 40.1,23.17
PB12: length 44.8
  Top Layer w0.254: v1(53.85,14.19) v1(53.85,11.39) ; v1(41.91,26.76) 41.53,26.76 40.81,26.04 U1.25
  Bottom Layer w0.254: v1(53.85,14.19) 50.55,14.19 49.15,15.58 43.18,15.58 38.74,20.03 38.74,23.97 41.53,26.76 v1(41.91,26.76) ; v1(53.85,11.39) 56.39,8.85 56.39,6.95 53.97,4.53 49.92,4.53 H8.14
PB13: length 23.7
  Top Layer w0.254: 48.56,46.7 48.56,34.47 U1.26
PB14: length 22.4
  Top Layer w0.254: 40.1,26.71 46.02,32.63 46.02,46.7
PB15: length 21.2
  Top Layer w0.254: 43.48,46.7 43.48,30.8 U1.28
PC13: length 29.8
  Top Layer w0.254: 15.49,3.26 15.62,3.39 v1(15.62,6.31) ; v1(28.32,22.44) 30.18,22.44 U1.2
  Bottom Layer w0.254: v1(15.62,6.31) 16.76,7.45 20.07,7.45 28.32,15.71 v1(28.32,22.44)
PC14: length 27.3
  Top Layer w0.254: v1(18.03,6.19) 18.03,3.26 ; v1(28.96,21.81) 30.25,21.81 31.62,23.17
  Bottom Layer w0.254: v1(18.03,6.19) 18.67,6.82 20.45,6.82 28.96,15.33 v1(28.96,21.81)
PC15: length 25.1
  Top Layer w0.254: v1(29.59,21.17) 30.32,21.17 U1.4 ; v1(20.32,6.19) 20.32,3.52 20.57,3.26
  Bottom Layer w0.254: v1(20.32,6.19) 20.57,6.19 29.59,15.2 v1(29.59,21.17)
PD0: length 10.3
  Top Layer w0.254: 32.32,22.47 29.76,19.9 28.96,19.9 27.84,18.79 X1.3 25.43,17.93 C2.2
PD1: length 9.9
  Top Layer w0.254: C1.2 27.8,15.32 29.46,16.98 29.46,18.09 X1.1 32.68,22.07 U1.6
RST: length 67
  Top Layer w0.254: 23.11,5.94 23.23,6.06 v1(25.02,6.06) 25.39,6.06 26.42,7.09 ; 23.11,5.94 23.11,3.26 ; 23.11,5.94 23.11,8.72 31.62,17.23 31.62,20.35 U1.7 ; SW1.2 61.15,6.95 59.18,6.95 56.77,9.36 55.5,9.36 v1(53.21,7.07)
  Bottom Layer w0.254: v1(53.21,7.07) 53.2,7.06 26.02,7.06 v1(25.02,6.06)
$1N3196: length 6.8
  Top Layer w0.254: R3.1 28.41,31.33 32.32,27.42
$1N3644: length 2.3
  Top Layer w0.254: LED1.2 5.64,24.56 R6.1
$1N3970: length 3
  Top Layer w0.254: LED2.2 3.79,41.87 5.37,40.29 R7.1
$1N9993: length 8.6
  Top Layer w0.254: USB.B5 9.39,31.59 10.03,30.95 14.03,30.95 14.17,30.81
$1N9997: length 5
  Top Layer w0.254: USB.A5 10.91,32.59 R1.2
$1N21284: length 4.1
  Top Layer w0.254: 52.01,8.47 51.18,8.47 50.55,9.11 50.55,11.41 Q1.1

## Copper pours and planes (outline as drawn; the poured copper is in the pictures)
+5V on Top Layer: 2.92,26.5 18.92,26.5 18.92,12.92 2.92,12.92
GND on Top Layer: 0,48 0.02,48.28 0.08,48.56 0.18,48.83 0.32,49.08 0.49,49.31 0.69,49.51 0.92,49.68 1.17,49.82 1.44,49.92 1.72,49.98 2,50 63,50 63.28,49.98 63.56,49.92 63.83,49.82 64.08,49.68 64.31,49.51 64.51,49.31 64.68,49.08 64.82,48.83 64.92,48.56 64.98,48.28 65,48 65,2 64.98,1.72 64.92,1.44 64.82,1.17 64.68,0.92 64.51,0.69 64.31,0.49 64.08,0.32 63.83,0.18 63.56,0.08 63.28,0.02 63,0 2,0 1.72,0.02 1.44,0.08 1.17,0.18 0.92,0.32 0.69,0.49 0.49,0.69 0.32,0.92 0.18,1.17 0.08,1.44 0.02,1.72 0,2
GND on Bottom Layer: 0,48 0.02,48.28 0.08,48.56 0.18,48.83 0.32,49.08 0.49,49.31 0.69,49.51 0.92,49.68 1.17,49.82 1.44,49.92 1.72,49.98 2,50 63,50 63.28,49.98 63.56,49.92 63.83,49.82 64.08,49.68 64.31,49.51 64.51,49.31 64.68,49.08 64.82,48.83 64.92,48.56 64.98,48.28 65,48 65,2 64.98,1.72 64.92,1.44 64.82,1.17 64.68,0.92 64.51,0.69 64.31,0.49 64.08,0.32 63.83,0.18 63.56,0.08 63.28,0.02 63,0 2,0 1.72,0.02 1.44,0.08 1.17,0.18 0.92,0.32 0.69,0.49 0.49,0.69 0.32,0.92 0.18,1.17 0.08,1.44 0.02,1.72 0,2

Small or netless copper shapes (teardrops, artwork), in the pictures only: 248 on Top Layer, 58 on Bottom Layer

## Text on the board
Top Silkscreen Layer: PC13 | PC14 | PC15 | RST | PA0 | PA1 | PA4 | PA5 | PA6 | PA7 | PB0 | PB1 | PB2 | PB12 | SWC | SWD | 3V3 | GND | DBUS | 5V | PB9 | PB8 | PB7 | PB6 | PB5 | 12M | PB4 | PB3 | PA15 | PA10 | PA9 | PA8 | PB15 | PB14 | PB13 | RX | PWR | 0 | 1 | DevKit Ver 2.0 20231006 | RoboMaster | STM32F103C8T6 | SEU-3SE | CANH | CANL | UART | RESET | BOOT1 | BOOT0
